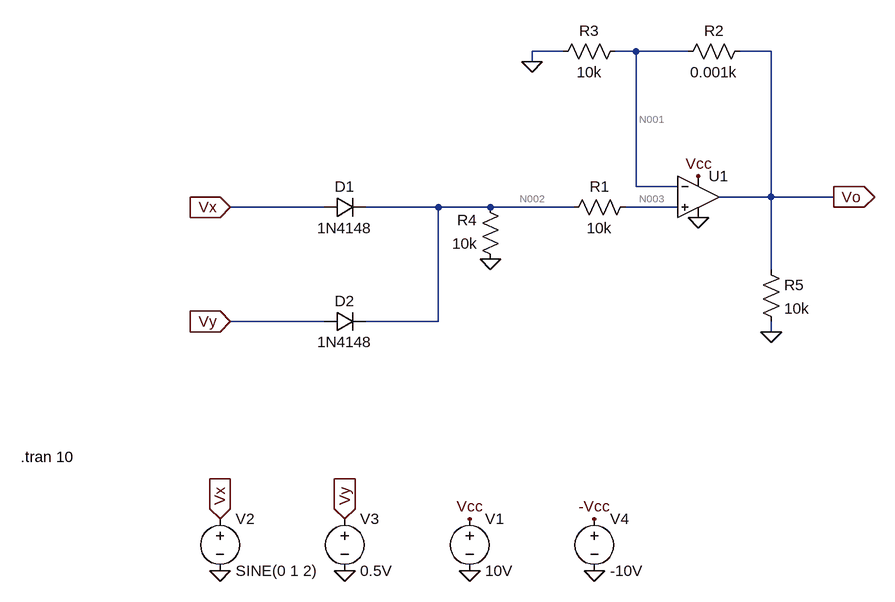
[diagram p0: schematic max.asc]
max.asc, the LTspice schematic file:
Version 4
SHEET 1 880 756
WIRE 64 -64 16 -64
WIRE 176 -64 144 -64
WIRE 256 -64 176 -64
WIRE 384 -64 336 -64
WIRE 16 -48 16 -64
WIRE 176 144 176 -64
WIRE 240 144 176 144
WIRE 384 160 384 -64
WIRE 384 160 304 160
WIRE 480 160 384 160
WIRE -304 176 -448 176
WIRE -128 176 -240 176
WIRE -48 176 -128 176
WIRE 80 176 -48 176
WIRE 240 176 160 176
WIRE 384 272 384 160
WIRE -304 352 -448 352
WIRE -128 352 -128 176
WIRE -128 352 -240 352
WIRE 384 368 384 352
FLAG 16 -48 0
FLAG -464 736 0
FLAG -272 736 0
FLAG 384 368 0
FLAG 480 160 Vo
IOPIN 480 160 Out
FLAG -464 656 Vx
IOPIN -464 656 In
FLAG -272 656 Vy
IOPIN -272 656 In
FLAG -448 176 Vx
IOPIN -448 176 In
FLAG -448 352 Vy
IOPIN -448 352 In
FLAG -80 736 0
FLAG -80 656 Vcc
FLAG 272 128 Vcc
FLAG 112 736 0
FLAG 112 656 -Vcc
FLAG 272 192 0
FLAG -48 256 0
SYMBOL OpAmps\\UniversalOpamp 272 160 R0
SYMATTR InstName U1
SYMBOL voltage -464 640 R0
WINDOW 123 0 0 Left 0
WINDOW 39 0 0 Left 0
SYMATTR InstName V2
SYMATTR Value SINE(0 1 2)
SYMBOL voltage -272 640 R0
WINDOW 123 0 0 Left 0
WINDOW 39 0 0 Left 0
SYMATTR InstName V3
SYMATTR Value 0.5V
SYMBOL res 176 160 R90
WINDOW 0 0 56 VBottom 2
WINDOW 3 32 56 VTop 2
SYMATTR InstName R1
SYMATTR Value 10k
SYMBOL res 352 -80 R90
WINDOW 0 0 56 VBottom 2
WINDOW 3 32 56 VTop 2
SYMATTR InstName R2
SYMATTR Value 0.001k
SYMBOL res 160 -80 R90
WINDOW 0 0 56 VBottom 2
WINDOW 3 32 56 VTop 2
SYMATTR InstName R3
SYMATTR Value 10k
SYMBOL diode -304 192 R270
WINDOW 0 32 32 VTop 2
WINDOW 3 0 32 VBottom 2
SYMATTR InstName D1
SYMATTR Value 1N4148
SYMBOL diode -304 368 R270
WINDOW 0 32 32 VTop 2
WINDOW 3 0 32 VBottom 2
SYMATTR InstName D2
SYMATTR Value 1N4148
SYMBOL res -32 272 R180
WINDOW 0 36 76 Left 2
WINDOW 3 36 40 Left 2
SYMATTR InstName R4
SYMATTR Value 10k
SYMBOL res 368 256 R0
SYMATTR InstName R5
SYMATTR Value 10k
SYMBOL voltage -80 640 R0
WINDOW 123 0 0 Left 0
WINDOW 39 0 0 Left 0
SYMATTR InstName V1
SYMATTR Value 10V
SYMBOL voltage 112 640 R0
WINDOW 123 0 0 Left 0
WINDOW 39 0 0 Left 0
SYMATTR InstName V4
SYMATTR Value -10V
TEXT -688 560 Right 2 !.tran 10

The netlist it stands for:
* max.asc
XU1 N003 N001 Vcc 0 Vo level1 Avol=1Meg GBW=10Meg Vos=0 En=0 Enk=0 In=0 Ink=0 Rin=500Meg  ; pins In+ In- V+ V- OUT
V2 Vx 0 SINE(0 1 2)
V3 Vy 0 0.5V
R1 N003 N002 10k
R2 Vo N001 0.001k
R3 N001 0 10k
D1 Vx N002 1N4148
D2 Vy N002 1N4148
R4 0 N002 10k
R5 Vo 0 10k
V1 Vcc 0 10V
V4 -Vcc 0 -10V
.model D D
.lib standard.dio
.tran 10
.lib UniversalOpAmp1.lib
.backanno
.end

* Results of the author's LTspice run, read from the files saved beside the schematic
* Operating Point, zero values left out:
*   V(n001) = 117.4 mV
*   V(n003) = 117.4 mV
*   V(vo) = 117.4 mV
*   V(vcc) = 10 V
*   V(vy) = 500 mV
*   V(n002) = 117.3 mV
*   V(-vcc) = -10 V
*   I(D2) = 11.72 µA
*   I(D1) = -2.331 nA
*   I(R5) = 11.74 µA
*   I(R4) = -11.73 µA
*   I(R3) = 11.74 µA
*   I(R2) = 11.73 µA
*   I(R1) = 9.765 nA
*   I(V1) = -5 µA
*   I(V3) = -11.72 µA
*   I(V2) = 2.331 nA
*   Ix(u1:1) = -9.765 nA
*   Ix(u1:2) = -9.765 nA
*   Ix(u1:3) = 5 µA
*   Ix(u1:4) = -5 µA
*   Ix(u1:5) = -23.47 µA
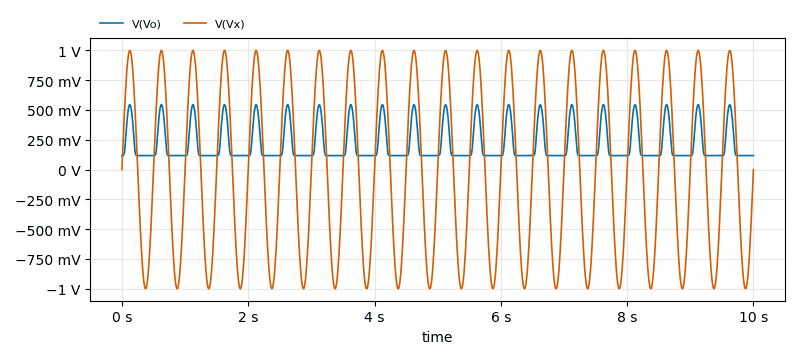
[diagram p1: Transient Analysis of max.asc, plotted from the saved traces]
* Transient Analysis, 1 run:
*   V(Vo): min 117.4 mV, max 545.3 mV, average 210.3 mV, rms 257.6 mV, last 117.4 mV
*   V(Vx): min -1 V, max 1 V, average 0 V, rms 707.1 mV, last 0 V